# EAGLE design cpu (EAGLE 7.0.0)
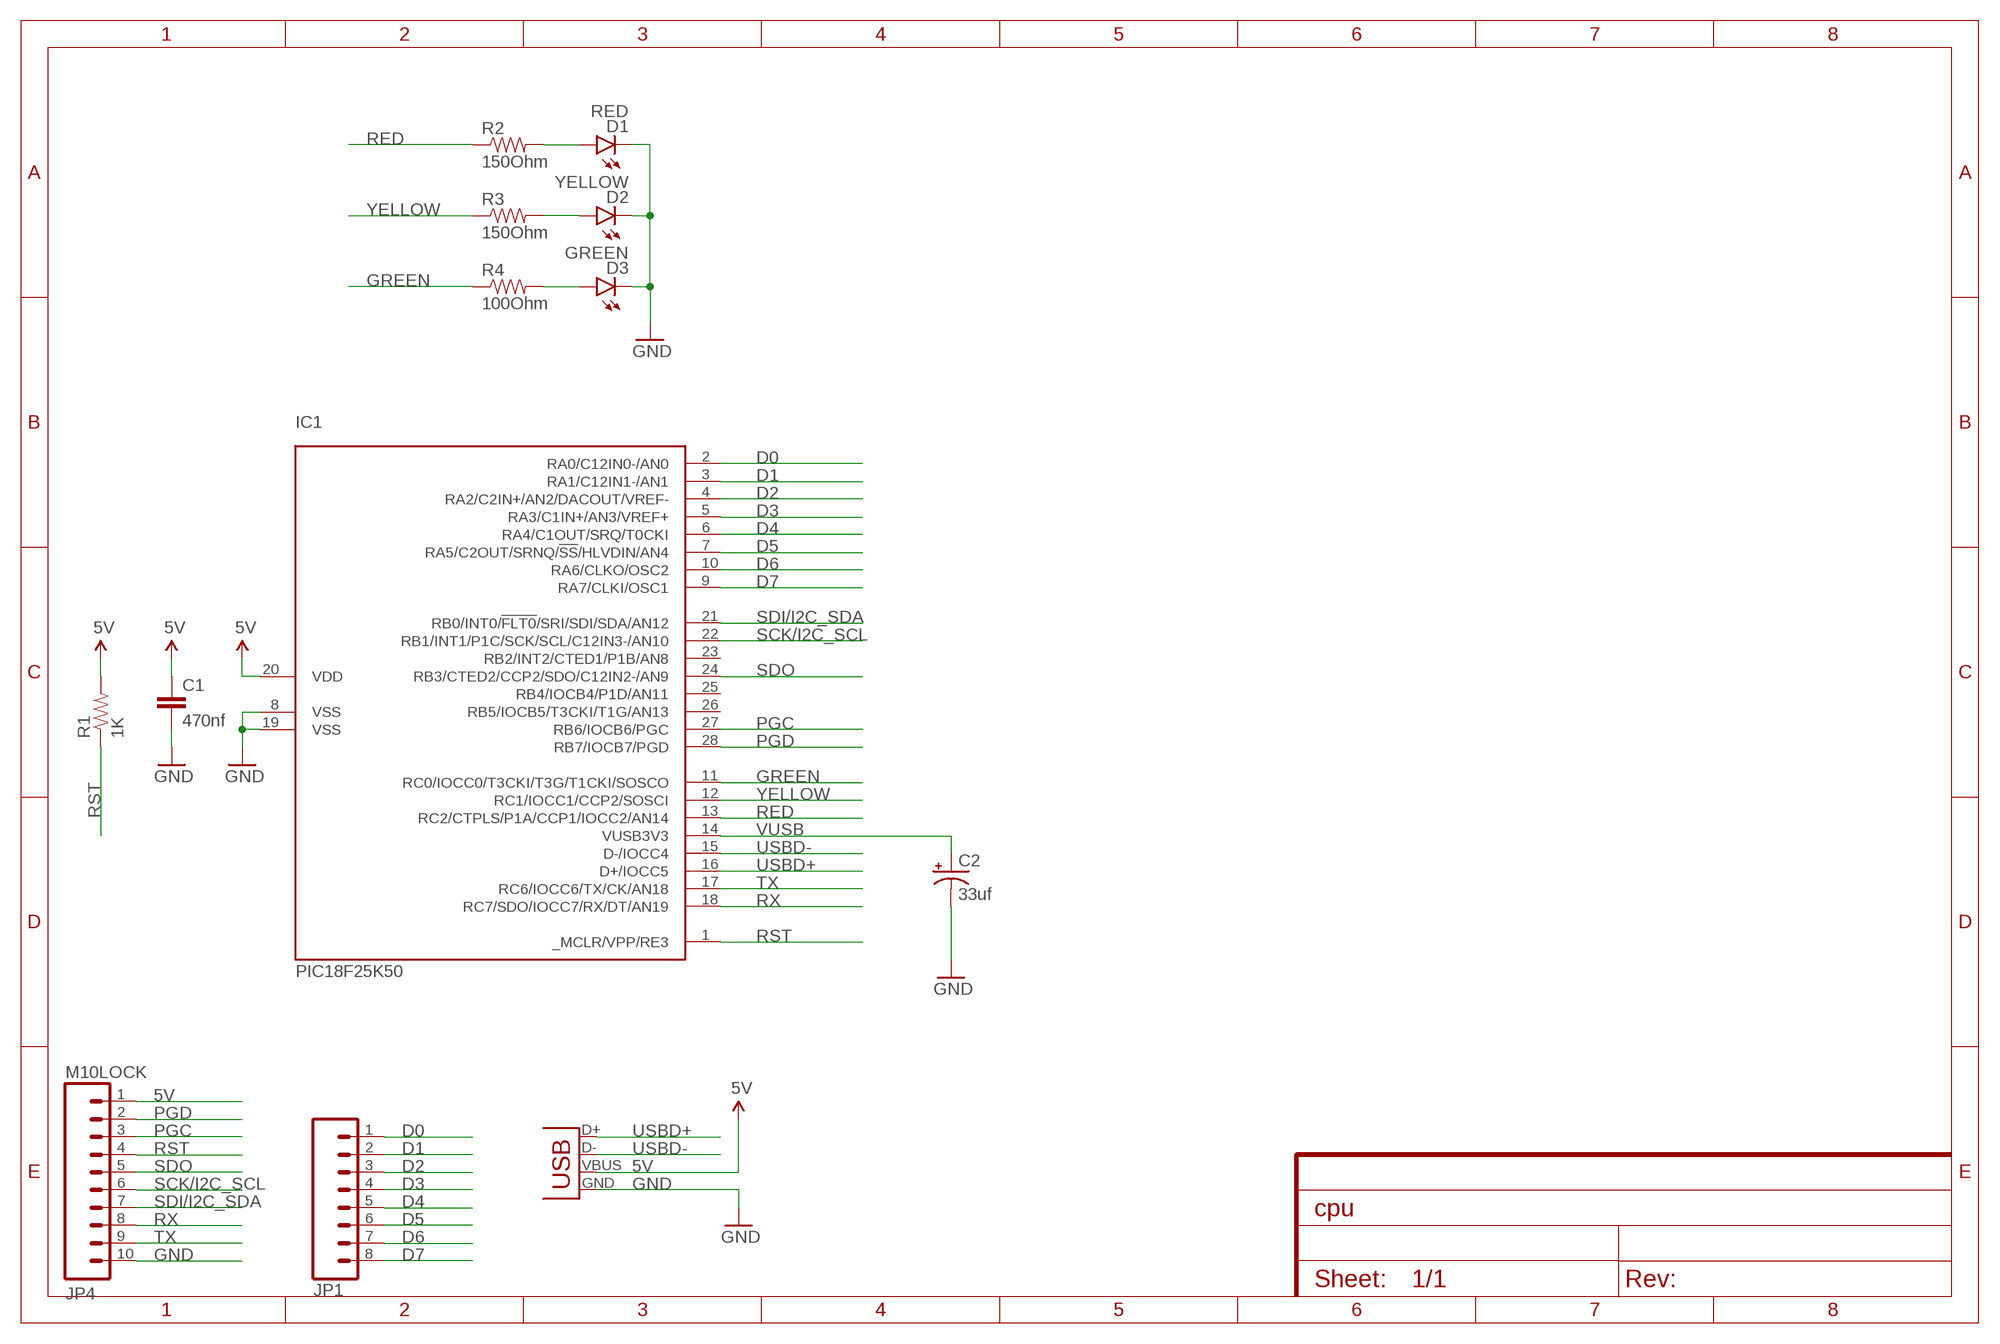
[diagram p0: schematic, sheet 1]

## Parts
C1  470nf  CAP0805  [0805]
C2  33uf  47UF-50V-20%(ELECT)  [PANASONIC_D]
D1  RED  LED-RED0603  [LED-0603]
D2  YELLOW  LED-YELLOW0603  [LED-0603]
D3  GREEN  LED-GREEN0603  [LED-0603]
IC1  PIC18F25K50  [SO-28W]
JP1  M08LOCK  [1X08_LOCK]
JP3  USBSMD  [USB-MINIB]
JP4  M10LOCK  [1X10_LOCK]
R1  1K  1KOHM1/10W1%(0603)  [0603-RES]
R2  150Ohm  RESISTOR0402-RES  [0402-RES]
R3  150Ohm  RESISTOR0402-RES  [0402-RES]
R4  100Ohm  RESISTOR0402-RES  [0402-RES]

## Nets
5V: C1.1 IC1.20(VDD) JP3.VBUS JP4.1 R1.2
D0: IC1.2(RA0/C12IN0-/AN0) JP1.1
D1: IC1.3(RA1/C12IN1-/AN1) JP1.2
D2: IC1.4(RA2/C2IN+/AN2/DACOUT/VREF-) JP1.3
D3: IC1.5(RA3/C1IN+/AN3/VREF+) JP1.4
D4: IC1.6(RA4/C1OUT/SRQ/T0CKI) JP1.5
D5: IC1.7(RA5/C2OUT/SRNQ/!SS!/HLVDIN/AN4) JP1.6
D6: IC1.10(RA6/CLKO/OSC2) JP1.7
D7: IC1.9(RA7/CLKI/OSC1) JP1.8
GND: C1.2 C2.- D1.C D2.C D3.C IC1.8(VSS) IC1.19(VSS) JP3.GND JP4.10
GREEN: IC1.11(RC0/IOCC0/T3CKI/T3G/T1CKI/SOSCO) R4.1
N$5: D1.A R2.2
N$6: D2.A R3.2
N$7: D3.A R4.2
PGC: IC1.27(RB6/IOCB6/PGC) JP4.3
PGD: IC1.28(RB7/IOCB7/PGD) JP4.2
RED: IC1.13(RC2/CTPLS/P1A/CCP1/IOCC2/AN14) R2.1
RST: IC1.1(_MCLR/VPP/RE3) JP4.4 R1.1
RX: IC1.18(RC7/SDO/IOCC7/RX/DT/AN19) JP4.8
SCK/I2C_SCL: IC1.22(RB1/INT1/P1C/SCK/SCL/C12IN3-/AN10) JP4.6
SDI/I2C_SDA: IC1.21(RB0/INT0/!FLT0!/SRI/SDI/SDA/AN12) JP4.7
SDO: IC1.24(RB3/CTED2/CCP2/SDO/C12IN2-/AN9) JP4.5
TX: IC1.17(RC6/IOCC6/TX/CK/AN18) JP4.9
USBD+: IC1.16(D+/IOCC5) JP3.D+
USBD-: IC1.15(D-/IOCC4) JP3.D-
VUSB: C2.+ IC1.14(VUSB3V3)
YELLOW: IC1.12(RC1/IOCC1/CCP2/SOSCI) R3.1
Unconnected: IC1.23(RB2/INT2/CTED1/P1B/AN8) IC1.25(RB4/IOCB4/P1D/AN11) IC1.26(RB5/IOCB5/T3CKI/T1G/AN13)

## Library data of the parts
C1 = SparkFun-Capacitors:CAP: Capacitor Standard 0603 ceramic capacitor, and 0.1" leaded capacitor.
C2 = SparkFun-Capacitors:47UF-50V-20%(ELECT): CAP-10547; PROD_ID: CAP-10547
D1 = SparkFun-LED:LED-RED: Assorted Red LEDs LilyPad 1206- DIO-09912 1206- DIO-00809 0603- DIO-00819; PROD_ID: DIO-00819
D2 = SparkFun-LED:LED-YELLOW: Yellow SMD LEDs LilyPad 1206- DIO-09909 0603- DIO-09003; PROD_ID: DIO-09003
D3 = SparkFun-LED:LED-GREEN: Various green LEDs Green LEDs used in SFE Production 0603- DIO-00821 LARGE- DIO-00862 LILYPAD- DIO-09910; PROD_ID: DIO-00821
IC1 = pic18f2xk50:PIC18F25K50
JP1 = SparkFun-Connectors:M08: Header 8 Standard 8-pin 0.1" header. Use with straight break away headers (SKU : PRT-00116), right angle break away headers (PRT-00553), swiss pins (PRT-00743), machine pins (PRT-00117), and female headers (PRT-00115).
JP3 = SparkFun-Connectors:USB: USB Connectors USB-B-PTH is fully proven SKU : PRT-00139/CONN-08278 USB-miniB is fully proven SKU : PRT-00587 USB-A-PCB is untested. USB-A-H is throughly reviewed, but untested. Spark Fun Electronics SKU : PRT-00437 USB-B-SMT is throughly reviewed, but untested. Needs silkscreen touching up. USB-A-S has not been used/tested USB-MB-H has not been used/tested USB-MICROB has been used. CONN-09505; PROD_ID: CONN-08193
JP4 = SparkFun-Connectors:M10: Header 10 Standard 10-pin 0.1" header. Use with straight break away headers (SKU : PRT-00116), right angle break away headers (PRT-00553), swiss pins (PRT-00743), machine pins (PRT-00117), and female headers (PRT-00115).
R1 = SparkFun-Resistors:1KOHM1/10W1%(0603): RES-07856; PROD_ID: RES-07856
R2-R4 = SparkFun-Passives:RESISTOR: Resistor Basic schematic elements and footprints for 0603, 1206, and PTH resistors.

## Board
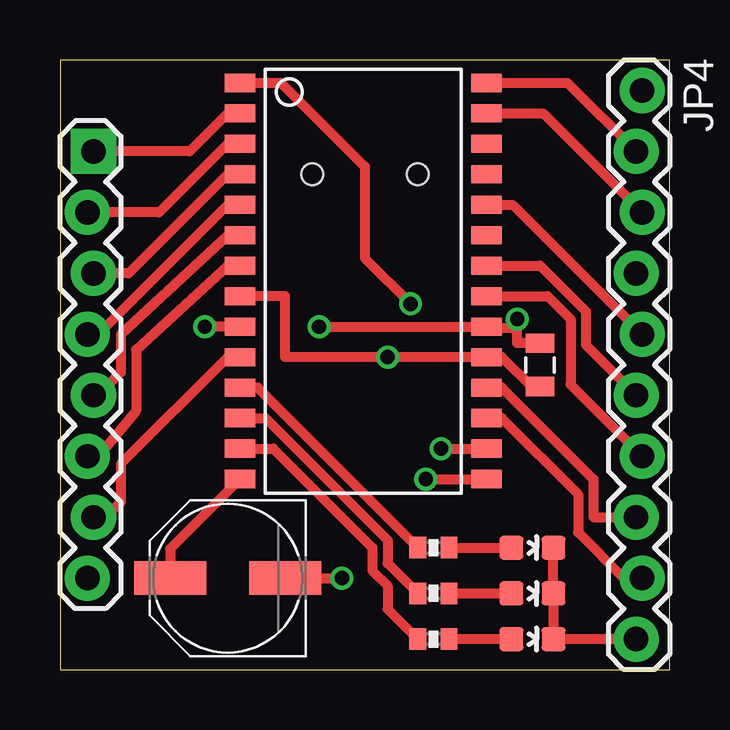
[diagram p1: board, top side]
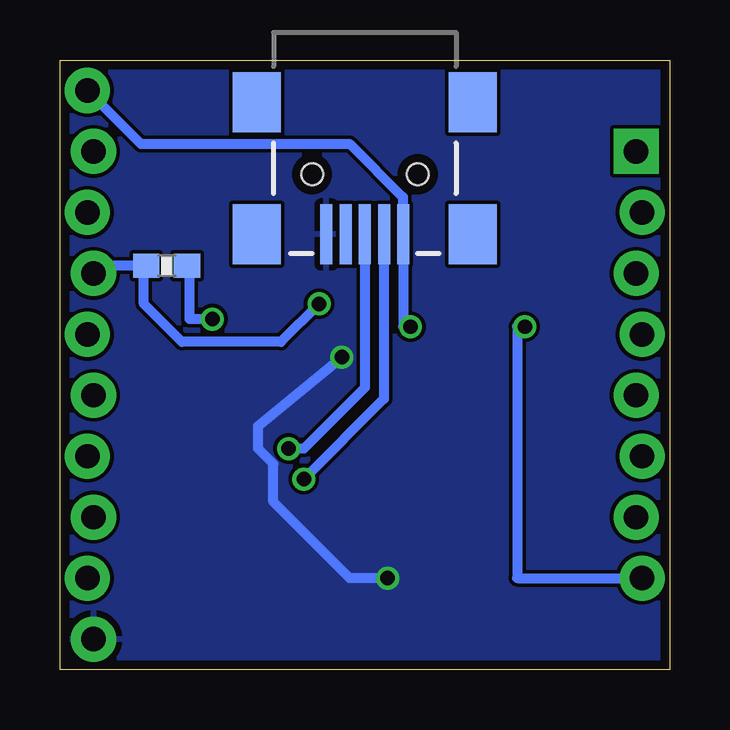
[diagram p2: board, bottom side, seen from below]

Size 25.4 x 25.4 mm. Coordinates in mm from the lower left corner, seen from the top.
Outline: 0,0 25.4,0 25.4,25.4 0,25.4 0,0
Copper layers (1*16): Top 0.0356mm / dielectric 1.5011mm / Bottom 0.0356mm
Design rules "LaenPCBOrder": minimum track width 6mil, minimum drill 13mil, track to track 6mil, track to pad 6mil, pad to pad 6mil, via to via 6mil, smd to smd 6mil, copper to edge 15mil, drill to drill 6mil, minimum pad ring 7mil, minimum via ring 7mil, stop-mask expansion 3mil, vias tented up to drill 0mil, thermal gap 10mil

### Footprints (pad centres in the part's own frame; a part is rotated, then mirrored left to right if it is on the bottom)
0805 = smd 0.8 x 1.2: 1 -0.9,0; 2 0.9,0
PANASONIC_D = smd 3 x 1.4: + 2.4,0; - -2.4,0
LED-0603 = smd 1 x 1: A 0,-0.877; C 0,0.877
SO-28W = smd 1.27 x 0.762: 1 -5.207,8.89; 2 -5.207,7.62; 3 -5.207,6.35; 4 -5.207,5.08; 5 -5.207,3.81; 6 -5.207,2.54; 7 -5.207,1.27; 8 -5.207,0; 9 -5.207,-1.27; 10 -5.207,-2.54; 11 -5.207,-3.81; 12 -5.207,-5.08; 13 -5.207,-6.35; 14 -5.207,-7.62; 15 5.08,-7.62; 16 5.08,-6.35; 17 5.08,-5.08; 18 5.08,-3.81; 19 5.08,-2.54; 20 5.08,-1.27; 21 5.08,0; 22 5.08,1.27; 23 5.08,2.54; 24 5.08,3.81; 25 5.08,5.08; 26 5.08,6.35; 27 5.08,7.62; 28 5.08,8.89
1X08_LOCK = drill 1.016 pad 1.88 square: 1 0,0.127 | drill 1.016 pad 1.88: 2 2.54,-0.127; 3 5.08,0.127; 4 7.62,-0.127; 5 10.16,0.127; 6 12.7,-0.127; 7 15.24,0.127; 8 17.78,-0.127
USB-MINIB = smd 2.5 x 0.5: D+ 2.5,0; D- 2.5,0.8; GND 2.5,-1.6; ID 2.5,-0.8; VBUS 2.5,1.6 | smd 2.5 x 2: MTN1 -3,4.5; MTN2 2.5,4.5; MTN3 -3,-4.5; MTN4 2.5,-4.5 | hole 0.9: 0,2.2; 0,-2.2
1X10_LOCK = drill 1.016 pad 1.88: 1 0,0.127; 2 2.54,-0.127; 3 5.08,0.127; 4 7.62,-0.127; 5 10.16,0.127; 6 12.7,-0.127; 7 15.24,0.127; 8 17.78,-0.127; 9 20.32,0.127; 10 22.86,-0.127
0603-RES = smd 1.1 x 1: 1 -0.85,0; 2 0.85,0
0402-RES = smd 0.7 x 0.9: 1 -0.65,0; 2 0.65,0

### Placement (x,y rotation side)
C1  20,12.7 270 top
C2  6.99,3.81 180 top
D1  19.68,1.27 270 top
D2  19.68,3.17 270 top
D3  19.68,5.08 270 top
IC1  12.7,15.56 0 top
JP1  1.27,21.59 270 top
JP3  12.7,20.64 270 bottom
JP4  24.13,24.13 270 top
R1  20.95,16.83 0 bottom
R2  15.56,1.27 0 top
R3  15.56,3.17 0 top
R4  15.56,5.08 0 top

### Tracks (layer width: path | path; a pad name or v marks a point on that pad's centre or on a via)
5V  (via drill 0.6)
  Top 0.406: v10.79,14.29 IC1.20 17.83,14.23 19.05,14.23 v19.05,14.61 | 19.05,14.29 v19.05,14.61 | C1.1 19.05,13.6 v19.05,14.61
  Bottom 0.406: v10.79,14.29 11.11,14.29 11.1,14.3 JP3.VBUS 11.11,18.15 11.11,19.68 13.34,21.91 22.04,21.91 JP4.1 | v19.05,14.61 20,14.61 20,16.73 R1.2
D0
  Top 0.406: IC1.2 6.99,23.18 5.4,21.59 JP1.1
D1
  Top 0.406: IC1.3 6.99,21.91 4.13,19.05 JP1.2
D2
  Top 0.406: IC1.4 6.99,20.64 2.86,16.51 JP1.3
D3
  Top 0.406: IC1.5 6.99,19.37 1.59,13.97 JP1.4
D4
  Top 0.406: IC1.6 6.99,18.1 2.54,13.97 2.54,12.38 1.59,11.43 JP1.5
D5
  Top 0.406: IC1.7 6.99,16.83 3.17,13.34 3.17,10.79 1.59,8.89 JP1.6
D6
  Top 0.406: IC1.10 6.99,13.02 2.54,8.57 2.54,6.99 1.91,6.35 JP1.7
D7  (via drill 0.6)
  Top 0.406: IC1.9 v6.03,14.29
  Bottom 0.406: v6.03,14.29 6.35,14.29 6.35,3.81 JP1.8
GND  (via drill 0.6)
  Top 0.406: IC1.8 9.38,15.56 9.38,13.02 v13.65,13.02 IC1.19 18.41,13.02 19.63,11.8 C1.2 | C2.- v11.75,3.81 | D3.C D2.C D1.C JP4.10
  Bottom 0.406: v11.75,3.81 13.34,3.81 16.51,6.99 16.51,8.57 17.14,9.21 17.14,10.16 v13.65,13.02
  pour Bottom: 0,25.4 25.4,25.4 25.4,0 0,0
GREEN
  Top 0.406: R4.1 8.24,11.75 IC1.11
N$5
  Top 0.406: D1.A R2.2
N$6
  Top 0.406: R3.2 D2.A
N$7
  Top 0.406: R4.2 D3.A
PGC
  Top 0.406: IC1.27 20.13,23.18 JP4.3
PGD
  Top 0.406: IC1.28 21.14,24.45 JP4.2
RED
  Top 0.406: IC1.13 8.89,9.21 13.02,5.08 13.02,4.13 13.65,3.49 13.65,2.52 R2.1
RST  (via drill 0.6)
  Top 0.406: IC1.1 9.21,24.45 12.7,20.95 12.7,17.14 v14.61,15.24
  Bottom 0.406: v14.61,15.24 16.19,13.65 20.32,13.65 21.91,15.24 21.91,16.83 | 21.91,16.83 R1.1 | 21.91,16.83 23.69,16.83 JP4.4
RX
  Top 0.406: IC1.18 18.41,11.75 22.23,7.94 22.23,6.35 JP4.8
SCK/I2C_SCL
  Top 0.406: IC1.22 20,16.83 21.91,14.92 21.91,13.53 JP4.6
SDI/I2C_SDA
  Top 0.406: IC1.21 20.32,15.56 21.27,14.61 21.27,11.87 JP4.7
SDO
  Top 0.406: IC1.24 18.86,19.37 JP4.5
TX
  Top 0.406: JP4.9 23.5,3.81 21.59,5.71 21.59,7.3 18.41,10.48 IC1.17
USBD+  (via drill 0.6)
  Top 0.406: v15.88,9.21 IC1.16
  Bottom 0.406: JP3.D+ 12.7,11.75 15.24,9.21 v15.88,9.21
USBD-  (via drill 0.6)
  Top 0.406: v15.24,7.94 IC1.15
  Bottom 0.406: JP3.D- 11.9,11.28 v15.24,7.94
VUSB
  Top 0.406: IC1.14 4.58,5.03 C2.+
YELLOW
  Top 0.406: IC1.12 8.57,10.48 13.65,5.4 13.65,4.43 R3.1